# Altium schematic sheet NUCLEO-F410RB-Wireless.SchDoc
size A4
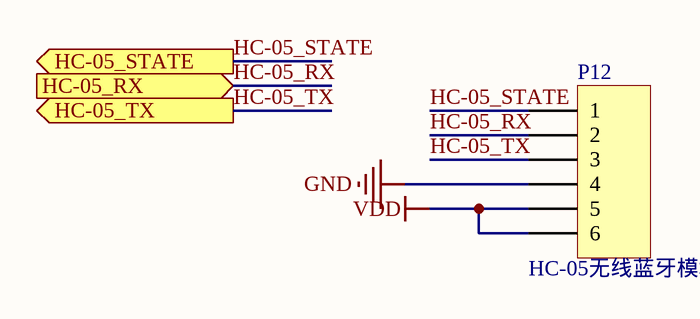
[diagram p0: NUCLEO-F410RB-Wireless.SchDoc]

## Parts
P12  HC-05无线蓝牙模块  [HDR1X6]

## Ports
HC-05_RX (in), HC-05_STATE (out), HC-05_TX (out)

## Nets
GND: P12.4
VDD: P12.5 P12.6
HC-05_RX: P12.2 ; port HC-05_RX
HC-05_STATE: P12.1 ; port HC-05_STATE
HC-05_TX: P12.3 ; port HC-05_TX

## Library data of the parts
P12 = Header 6: Header, 6-Pin; LatestRevisionDate: 17-Jul-2002; LatestRevisionNote: Re-released for DXP Platform.; Publisher: Altium Limited